# Altium schematic sheet config-bank2.SchDoc: Config FPGA - Bank 2
size Letter; CompanyName: Brinton Engineering, LLC; Address1: 3479 Edison Way; Address2: Menlo Park CA 94025; Address3: +1 (877) 778-8435; Address4: brintonengineering.com; Revision: 1; SheetNumber: 1; SheetTotal: 1
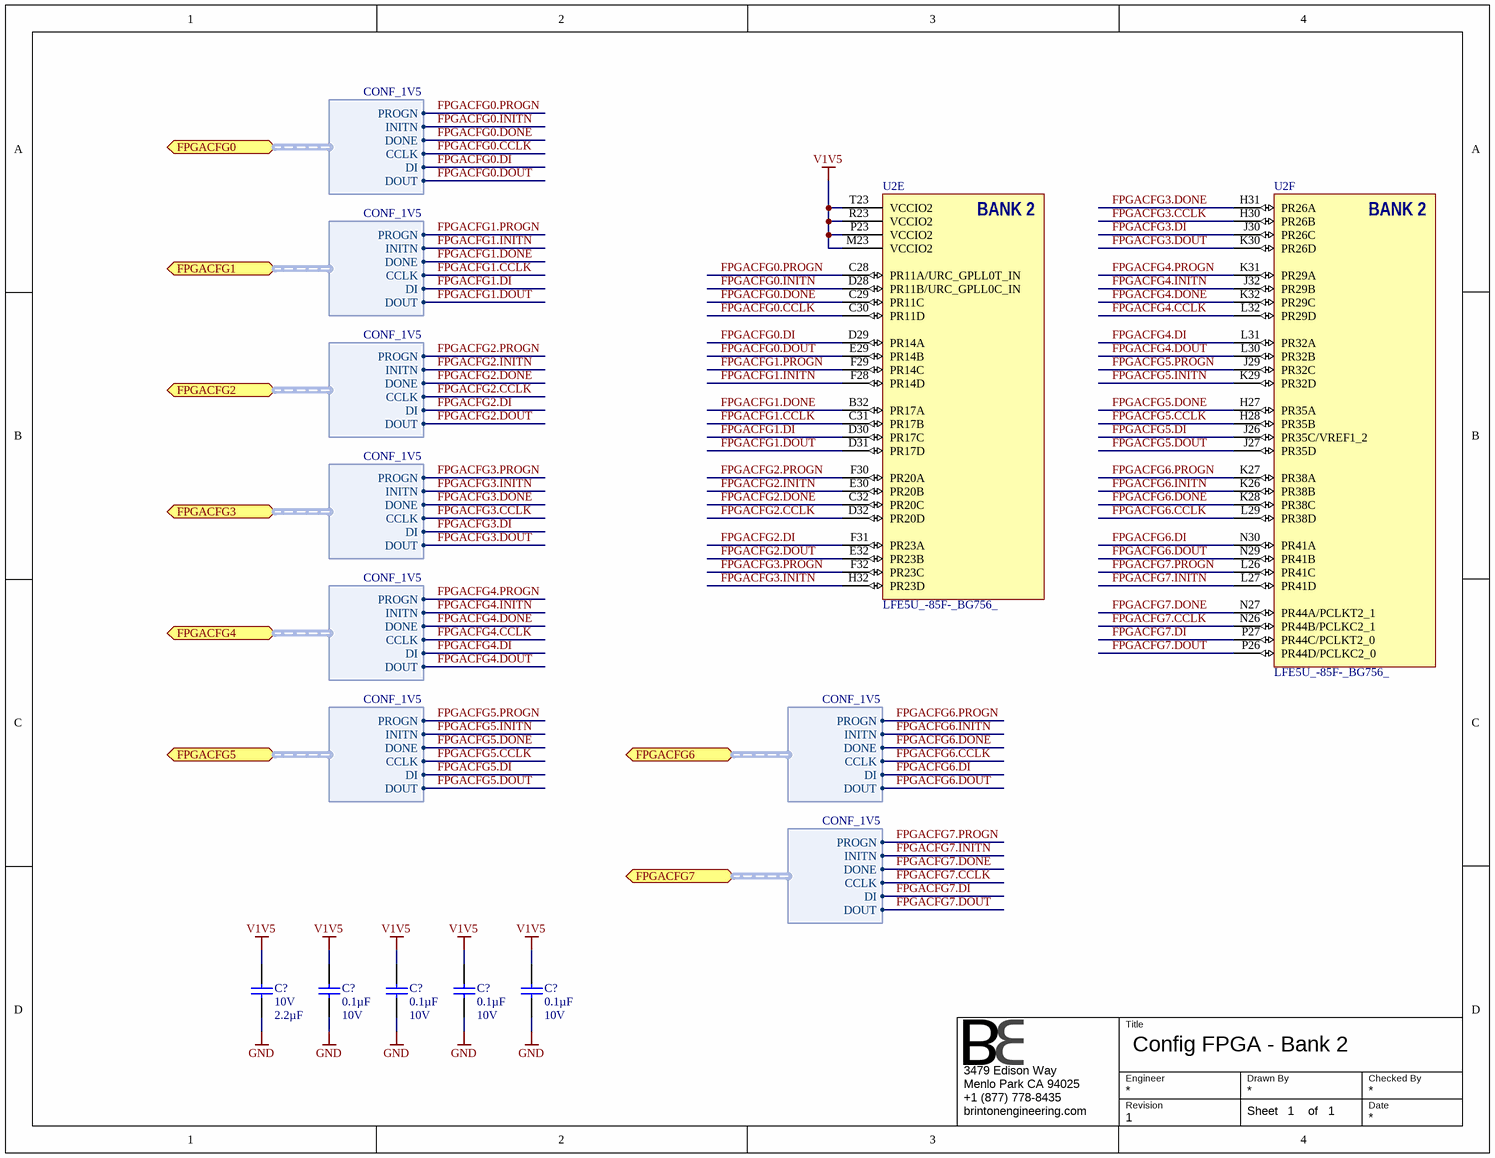
[diagram p0: config-bank2.SchDoc]

## Parts
(Parts that share a designator on the sheet are numbered #1, #2 ... from top to bottom, then left to right.)
C?#1  Voltage - Rated: 10V  Capacitance: 2.2µF  [CAPC1608X90N]  (hidden comment: GRM188R71A225KE15D)
C?#2  Capacitance: 0.1µF  Voltage - Rated: 10V  [CAPC1005X56N]  (hidden comment: GRM155R71A104KA01J)
C?#3  Capacitance: 0.1µF  Voltage - Rated: 10V  [CAPC1005X56N]  (hidden comment: GRM155R71A104KA01J)
C?#4  Capacitance: 0.1µF  Voltage - Rated: 10V  [CAPC1005X56N]  (hidden comment: GRM155R71A104KA01J)
C?#5  Capacitance: 0.1µF  Voltage - Rated: 10V  [CAPC1005X56N]  (hidden comment: GRM155R71A104KA01J)
U2  LFE5U_-85F-_BG756_  [caBGA756]  (parts E,F of 19)

## Ports
FPGACFG0 (harness CONF_1V5), FPGACFG1 (harness CONF_1V5), FPGACFG2 (harness CONF_1V5), FPGACFG3 (harness CONF_1V5), FPGACFG4 (harness CONF_1V5), FPGACFG5 (harness CONF_1V5), FPGACFG6 (harness CONF_1V5), FPGACFG7 (harness CONF_1V5)

## Harnesses
CONF_1V5: PROGN, INITN, DONE, CCLK, DI, DOUT

## Nets
GND: C?#1.1 C?#2.1 C?#3.1 C?#4.1 C?#5.1
V1V5: C?#1.2 C?#2.2 C?#3.2 C?#4.2 C?#5.2 U2.M23(VCCIO2) U2.P23(VCCIO2) U2.R23(VCCIO2) U2.T23(VCCIO2)
FPGACFG0.CCLK: U2.C30(PR11D) ; port FPGACFG0.CCLK
FPGACFG0.DI: U2.D29(PR14A) ; port FPGACFG0.DI
FPGACFG0.DONE: U2.C29(PR11C) ; port FPGACFG0.DONE
FPGACFG0.DOUT: U2.E29(PR14B) ; port FPGACFG0.DOUT
FPGACFG0.INITN: U2.D28(PR11B/URC_GPLL0C_IN) ; port FPGACFG0.INITN
FPGACFG0.PROGN: U2.C28(PR11A/URC_GPLL0T_IN) ; port FPGACFG0.PROGN
FPGACFG1.CCLK: U2.C31(PR17B) ; port FPGACFG1.CCLK
FPGACFG1.DI: U2.D30(PR17C) ; port FPGACFG1.DI
FPGACFG1.DONE: U2.B32(PR17A) ; port FPGACFG1.DONE
FPGACFG1.DOUT: U2.D31(PR17D) ; port FPGACFG1.DOUT
FPGACFG1.INITN: U2.F28(PR14D) ; port FPGACFG1.INITN
FPGACFG1.PROGN: U2.F29(PR14C) ; port FPGACFG1.PROGN
FPGACFG2.CCLK: U2.D32(PR20D) ; port FPGACFG2.CCLK
FPGACFG2.DI: U2.F31(PR23A) ; port FPGACFG2.DI
FPGACFG2.DONE: U2.C32(PR20C) ; port FPGACFG2.DONE
FPGACFG2.DOUT: U2.E32(PR23B) ; port FPGACFG2.DOUT
FPGACFG2.INITN: U2.E30(PR20B) ; port FPGACFG2.INITN
FPGACFG2.PROGN: U2.F30(PR20A) ; port FPGACFG2.PROGN
FPGACFG3.CCLK: U2.H30(PR26B) ; port FPGACFG3.CCLK
FPGACFG3.DI: U2.J30(PR26C) ; port FPGACFG3.DI
FPGACFG3.DONE: U2.H31(PR26A) ; port FPGACFG3.DONE
FPGACFG3.DOUT: U2.K30(PR26D) ; port FPGACFG3.DOUT
FPGACFG3.INITN: U2.H32(PR23D) ; port FPGACFG3.INITN
FPGACFG3.PROGN: U2.F32(PR23C) ; port FPGACFG3.PROGN
FPGACFG4.CCLK: U2.L32(PR29D) ; port FPGACFG4.CCLK
FPGACFG4.DI: U2.L31(PR32A) ; port FPGACFG4.DI
FPGACFG4.DONE: U2.K32(PR29C) ; port FPGACFG4.DONE
FPGACFG4.DOUT: U2.L30(PR32B) ; port FPGACFG4.DOUT
FPGACFG4.INITN: U2.J32(PR29B) ; port FPGACFG4.INITN
FPGACFG4.PROGN: U2.K31(PR29A) ; port FPGACFG4.PROGN
FPGACFG5.CCLK: U2.H28(PR35B) ; port FPGACFG5.CCLK
FPGACFG5.DI: U2.J26(PR35C/VREF1_2) ; port FPGACFG5.DI
FPGACFG5.DONE: U2.H27(PR35A) ; port FPGACFG5.DONE
FPGACFG5.DOUT: U2.J27(PR35D) ; port FPGACFG5.DOUT
FPGACFG5.INITN: U2.K29(PR32D) ; port FPGACFG5.INITN
FPGACFG5.PROGN: U2.J29(PR32C) ; port FPGACFG5.PROGN
FPGACFG6.CCLK: U2.L29(PR38D) ; port FPGACFG6.CCLK
FPGACFG6.DI: U2.N30(PR41A) ; port FPGACFG6.DI
FPGACFG6.DONE: U2.K28(PR38C) ; port FPGACFG6.DONE
FPGACFG6.DOUT: U2.N29(PR41B) ; port FPGACFG6.DOUT
FPGACFG6.INITN: U2.K26(PR38B) ; port FPGACFG6.INITN
FPGACFG6.PROGN: U2.K27(PR38A) ; port FPGACFG6.PROGN
FPGACFG7.CCLK: U2.N26(PR44B/PCLKC2_1) ; port FPGACFG7.CCLK
FPGACFG7.DI: U2.P27(PR44C/PCLKT2_0) ; port FPGACFG7.DI
FPGACFG7.DONE: U2.N27(PR44A/PCLKT2_1) ; port FPGACFG7.DONE
FPGACFG7.DOUT: U2.P26(PR44D/PCLKC2_0) ; port FPGACFG7.DOUT
FPGACFG7.INITN: U2.L27(PR41D) ; port FPGACFG7.INITN
FPGACFG7.PROGN: U2.L26(PR41C) ; port FPGACFG7.PROGN

## Notes on the sheet
- Title
- Engineer
- Revision
- Drawn By
- Checked By
- Date
- Sheet
- of
- (in symbol LFE5U_-85F-_BG756_, part E) BANK 2
- (in symbol LFE5U_-85F-_BG756_, part F) BANK 2

## Library data of the parts
C?#1 = GRM188R71A225KE15D: CAP CER 2.2UF 10V 10% X7R 0603; Manufacturer: Murata Electronics North America; Manufacturer P/N: GRM188R71A225KE15D; Operating Temperature: -55°C ~ 125°C; Thickness (Max): 0.035" (0.90mm); Tolerance: ±10%; Package / Case: 0603 (1608 Metric); Temperature Coefficient: X7R; Supplier 1: Newark; Supplier 2: Digi-Key; RoHS: RoHS Compliant; Size / Dimension: 0.063" L x 0.031" W (1.60mm x 0.80mm); Mounting Type: Surface Mount, MLCC; ComponentLink1URL: http://www.murata.com/~/media/webrenewal/support/library/catalog/products/capacitor/mlcc/c02e.ashx; ComponentLink1Description: http://www.murata.com/~/media/webrenewal/support/library/catalog/products/capacitor/mlcc/c02e.ashx; Supplier Part Number 1: 72R4209; Supplier Part Number 2: 490-4520-1-ND
C?#2-C?#5 = GRM155R71A104KA01J: CAP CER 0.1UF 10V 10% X7R 0402; Manufacturer: Murata Electronics North America; Manufacturer P/N: GRM155R71A104KA01J; Operating Temperature: -55°C ~ 125°C; Thickness (Max): 0.022" (0.55mm); Size / Dimension: 0.039" L x 0.020" W (1.00mm x 0.50mm); RoHS: RoHS Compliant; Mounting Type: Surface Mount, MLCC; Supplier 1: Digi-Key; ComponentLink1URL: http://www.murata.com/~/media/webrenewal/support/library/catalog/products/capacitor/mlcc/c02e.ashx; ComponentLink1Description: http://www.murata.com/~/media/webrenewal/support/library/catalog/products/capacitor/mlcc/c02e.ashx; Supplier Part Number 1: 490-6322-1-ND; Temperature Coefficient: X7R; Package / Case: 0402 (1005 Metric); Tolerance: ±10%
U2 = LFE5U_-85F-_BG756_: ECP5 FPGA, 85k LUT, 756-caBGA; Manufacturer: Lattice Semiconductor; Manufacturer P/N: LFE5U_-85F-_BG756_